# Altium schematic sheet PowerBoard.schdoc: Контроллер двигателя
size 420 x 297 mm; ApprovedBy: Алексеев; CheckedBy: Алексеев; DrawnBy: Подлесный; DocumentNumber: КПТВ.758345.016 Э3; SheetTotal: 1; Title1str: (при необходимости вторая строка); DocumentType: Схема электрическая принципиальная; Format: A3; ImagePath: КПТВ.758345.016
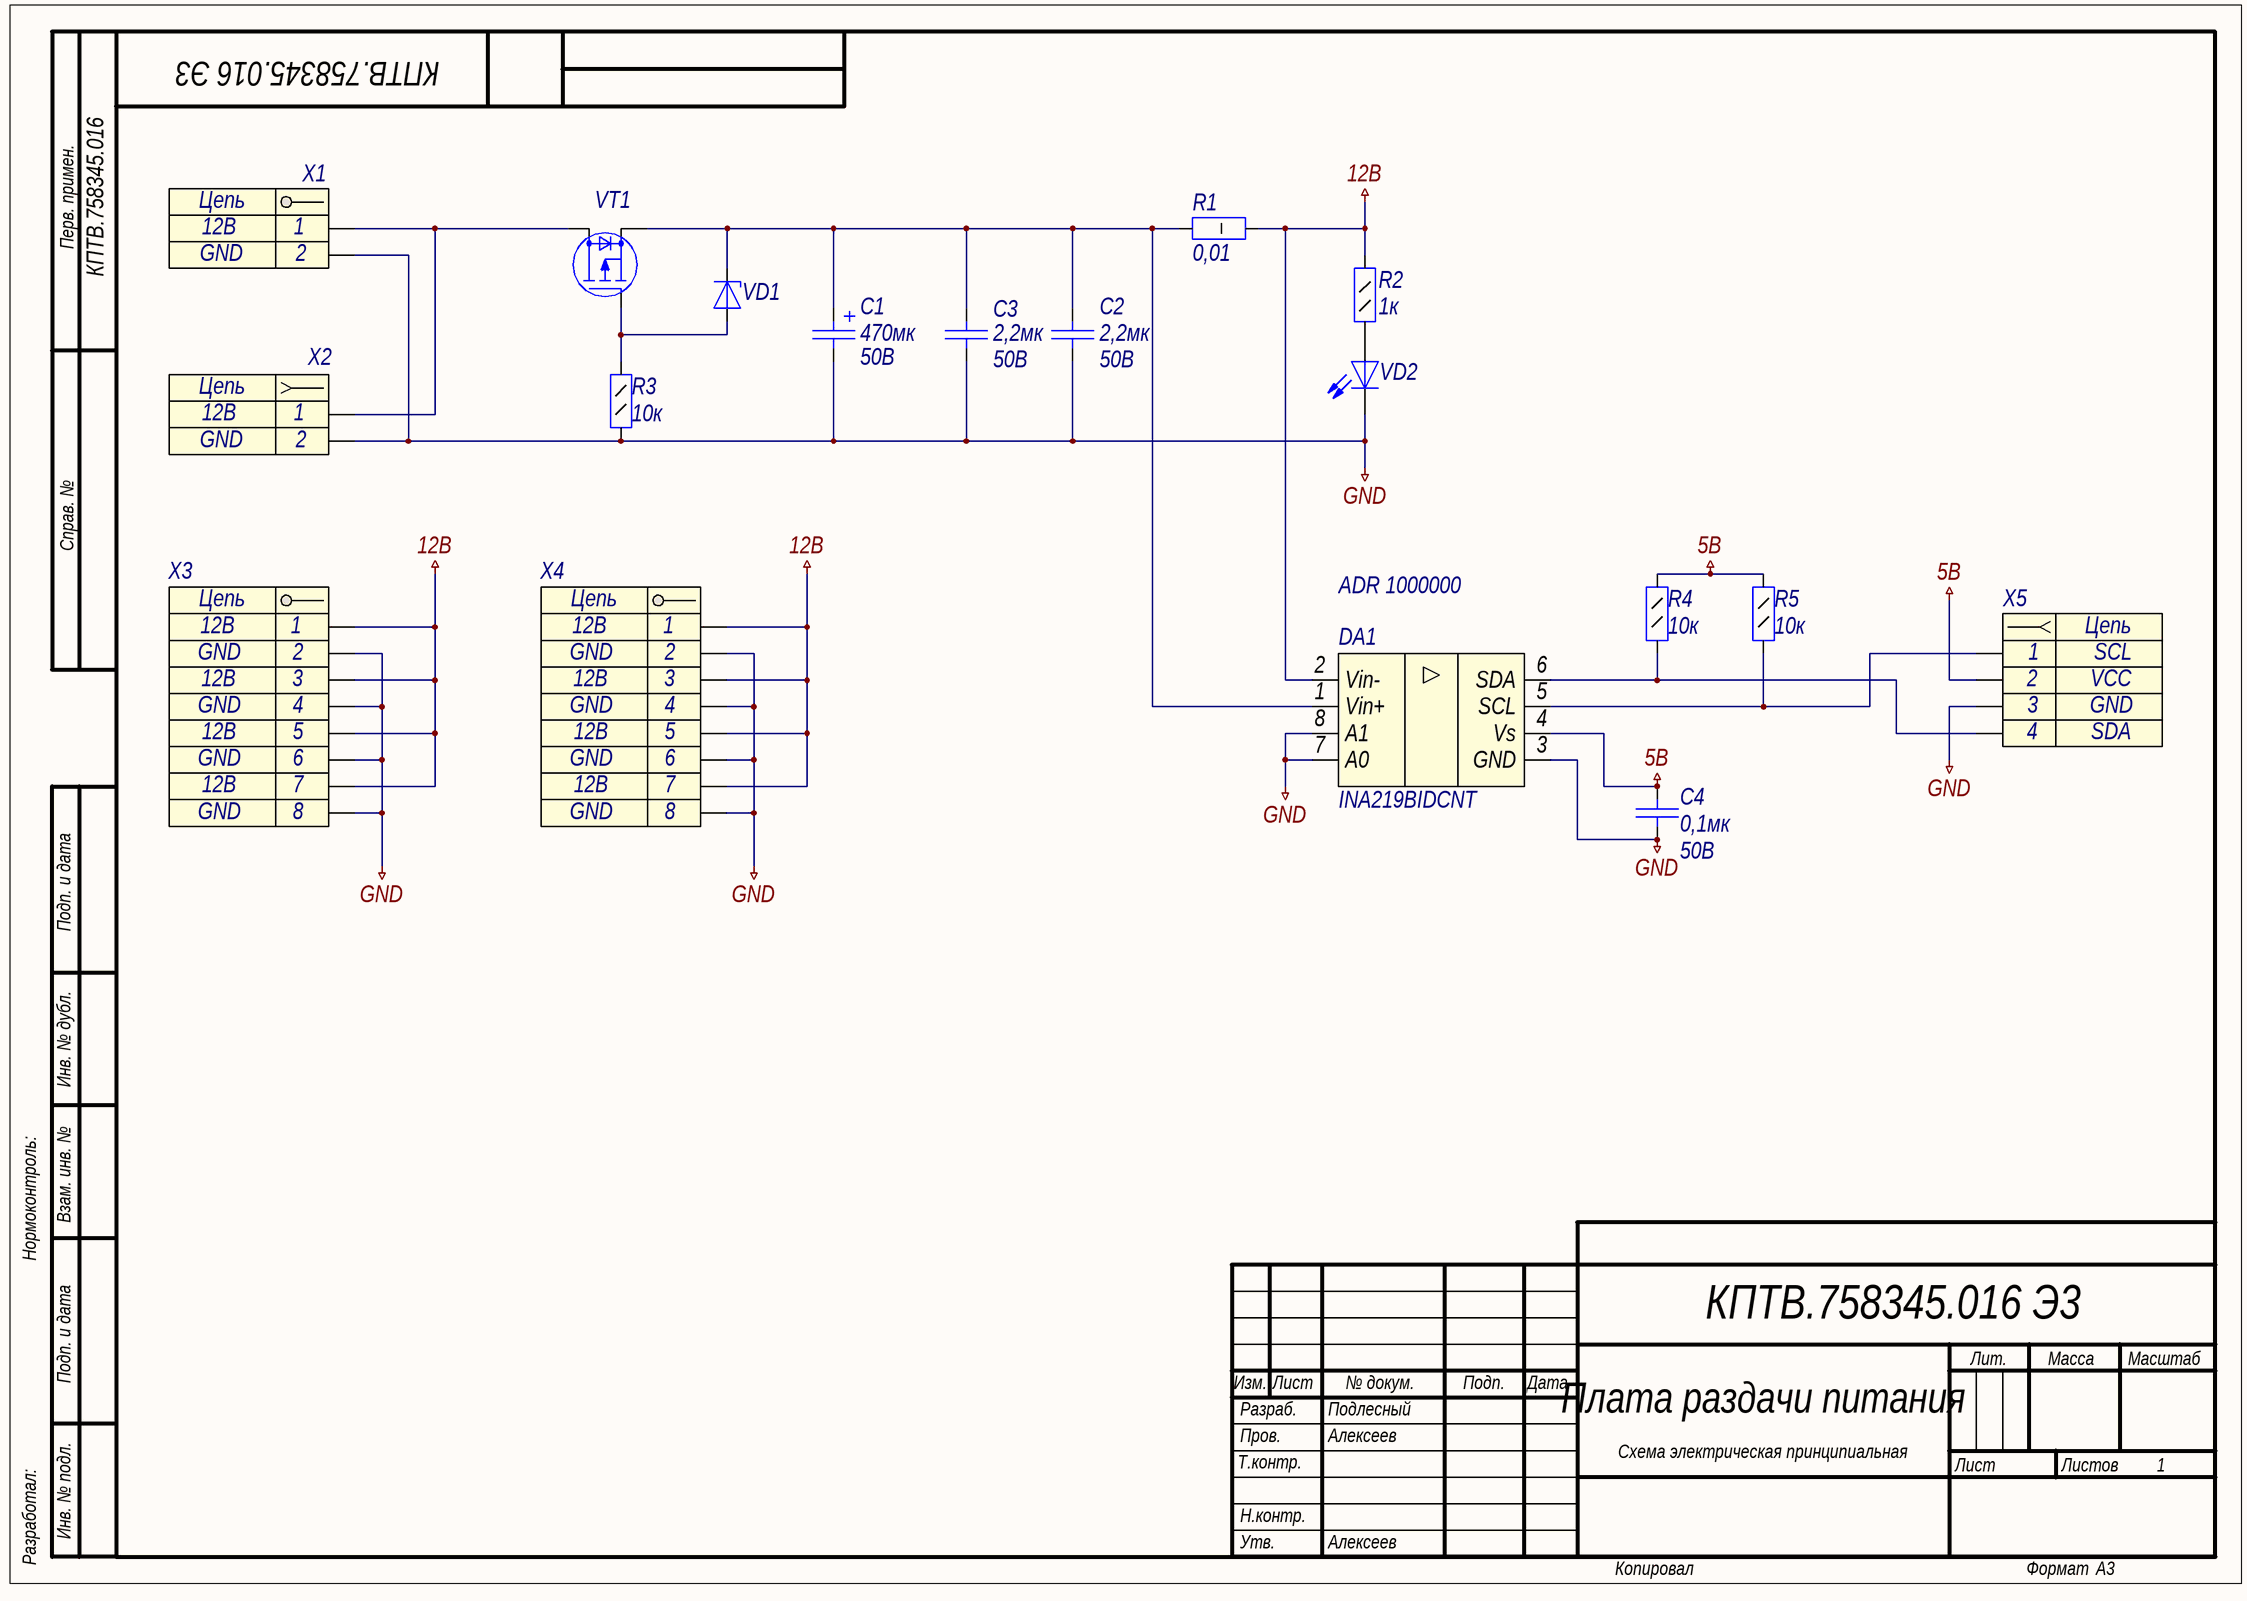
[diagram p0: PowerBoard.schdoc]

## Parts
C1  value 470мк  Voltage: 50В  [K50-35(10X20)_V]  (hidden comment: Capacitor_pol)
C2  value 2,2мк  Voltage: 50В  [C1206]  (hidden comment: Capacitor)
C3  value 2,2мк  Voltage: 50В  [C1206]  (hidden comment: Capacitor)
C4  value 0,1мк  Voltage: 50В  [C0805]  (hidden comment: Capacitor)
DA1  INA219BIDCNT  [SOT23-8]
R1  value 0,01  [R2512]  (hidden comment: Resistor_1Вт)
R2  value 1к  [R0805]  (hidden comment: Resistor_0,125Вт)
R3  value 10к  [R0805]  (hidden comment: Resistor_0,125Вт)
R4  value 10к  [R0805]  (hidden comment: Resistor_0,125Вт)
R5  value 10к  [R0805]  (hidden comment: Resistor_0,125Вт)
VD1  DiodeZener  [SMA]  (value not drawn)
VD2  LED  [L_0805]  (value not drawn)
VT1  P-MOSFET  [DPAK]  (value not drawn)
X1  Header_2_trm  [TERMINAL-2WAY-5MM]  (value not drawn)
X2  Header_2_sct  [XT60-F]  (value not drawn)
X3  Header_8_trm  [TERMINAL-8WAY-3.5MM]  (value not drawn)
X4  Header_8_trm  [TERMINAL-8WAY-3.5MM_]  (value not drawn)
X5  Header_4_sct  [69254-002LF]  (value not drawn)

## Nets
5B: C4.2 DA1.4(Vs) R4.1 R5.1 X5.2
12B: DA1.2(Vin-) R1.2 R2.2 X3.1 X3.3 X3.5 X3.7 X4.1 X4.3 X4.5 X4.7
GND: C1.2 C2.1 C3.1 C4.1 DA1.3(GND) DA1.7(A0) DA1.8(A1) R3.2 VD2.1(K) X1.2 X2.2 X3.2 X3.4 X3.6 X3.8 X4.2 X4.4 X4.6 X4.8 X5.3
NetC1_1: C1.1 C2.2 C3.2 DA1.1(Vin+) R1.1 VD1.1(K) VT1.3(S)
NetDA1_5: DA1.5(SCL) R5.2 X5.1
NetDA1_6: DA1.6(SDA) R4.2 X5.4
NetR2_1: R2.1 VD2.2(A)
NetR3_1: R3.1 VD1.2(A) VT1.1(G)
NetVT1_2: VT1.2(D) X1.1 X2.1

## Notes on the sheet
- Перв. примен.
- Справ. №
- ADR 1000000
- Подп. и дата
- Инв. № дубл.
- Нормоконтроль:
- Взам. инв. №
- Изм.
- Лист
- № докум.
- Подп.
- Дата
- Лит.
- Масса
- Масштаб
- Т.контр.
- Пров.
- Разраб.
- Плата раздачи питания
- Листов
- Разработал:
- Инв. № подл.
- Н.контр.
- Утв.
- Копировал
- Формат
- (in symbol connect21) Цепь
- (in symbol connect63) Цепь
- (in symbol connect64) Цепь
- (in symbol connect67) Цепь
- (in symbol connect68) Цепь

## Library data of the parts
C1 = cap203: Конденсатор полярный; Part Name: Electrolit; Manufacture: Jamicon; Part Number: TKR471M1HG20; id: cap203; tga: 0,10%
C2 C3 = cap188: Конденсатор; Part Name: Capacitors; Part Number: GRM31CR71H225KA88**L; id: cap188; TKE: X7R
C4 = cap161: Конденсатор; Part Name: Capacitors; Part Number: GRM21BR71H104KA01L; id: cap161; TKE: X7R
DA1 = interf16: Токочувствительный усилитель; Part Name: Current/Power Monitor With I 2C Interface; Manufacture: Texas Instruments; Resolution: 12bit; Address: A0 A1 adress pin; Offset voltage: 40uB; Bandwidth: 11kHz; CMRR: 120dB; Number of Channel: 1; Input channel: diff; Type Supply: Single Polar; Power Supply: 3.0-5.5V; id: interf16; Part Number: INA219BIDCNT
R1 = res777: Резистор; Manufacture: Yageo; Part Number: RL2512FK-070R01L; id: res777; Power: 1Вт; Part Name: Resistor; Accuracy: 0,01
R2 = res76: Резистор; Manufacture: Yageo; Part Number: RC0805FR-071KL; id: res76; Accuracy: 0,01; Part Name: Resistor; Power: 0,125Вт
R3-R5 = res97: Резистор; id: res97; Accuracy: 1%; Part Name: Resistor; Power: 0,125Вт
VD1 = SMAJ12A: Cтабилитрон (лавинный выпрямительный диод) односторонний; Part Name: TVS diode Unidirectional; Manufacture: ST Microelectronics; id: tvs128; Leakage Current: 0,2uA; Stand-off Voltage: 12B; Breakdown Voltage: 14B; Clamping voltage: 19,9B; Dynamic resistance: 0,259Ohm; Peak Pulse Power: 400W; Number of diodes: 1; Part Number: SMAJ12A
VD2 = diode5: Светодиод; Part Number: KP-2012EC; id: diode5; Part Name: LED
VT1 = mosfert8: N-MOSFET; Part Number: FDD6637; Manufacturer: Fairchild Semiconductor; Structure: p-channel; V drain-source max: (-35B); Rds: 0,0116Ohm; Gate-to-source voltage: (+-)25B; Continuous drain current: (-55)A; Pulsed drain current: (-100)A; Power dissipation: 57W; id: mosfert8
X1 = connect21: Разъем - 2 конт. клеммник; Part Name: TERMINAL BLOCK 2 way; Contact_1: 12B; Contact_2: GND; Etch: 5mm; id: connect21
X2 = connect64: Разъем - 2 конт. розетка; Part Number: XT60-F.G2.Y; Manufacture: Amass Electronics; Contact_1: 12B; Contact_2: GND; Etch: 7.2mm; Part Name: XT60-F; id: connect64
X3 = connect67: Разъем - 8 конт. вилка; Part Name: TERMINAL BLOCK 8 way; Contact_1: 12B; Contact_2: GND; Etch: 3.5mm; Contact_3: 12B; Contact_4: GND; Contact_5: 12B; Contact_6: GND; id: connect67; Contact_7: 12B; Contact_8: GND
X4 = connect68: Разъем - 8 конт. вилка; Part Name: TERMINAL BLOCK 8 way; Contact_1: 12B; Contact_2: GND; Etch: 3.5mm; Contact_48: #ИМЯ?; Contact_3: 12B; Contact_4: GND; Contact_5: 12B; Contact_6: GND; id: connect68; Contact_7: 12B; Contact_8: GND
X5 = connect63: Разъем - 4 конт. розетка; Part Name: Jack 6p4c (RJ11, RJ14) Vertical; Manufacture: Amphenol ICC (FCI); Contact_1: SCL; Contact_2: VCC; Contact_3: GND; Contact_4: SDA; id: connect63; Part Number: 69254-002LF